# EasyEDA Pro project 舵轮组分电板.eprj

# Schematic Schematic1
Create Date: 2023-06-24; Page Name: P1; Project Name: 舵轮组分电板; Schematic Name: Schematic1; Update Date: 2023-06-24; Company: 嘉立创EDA; Page Size: A4; Version: V1.0
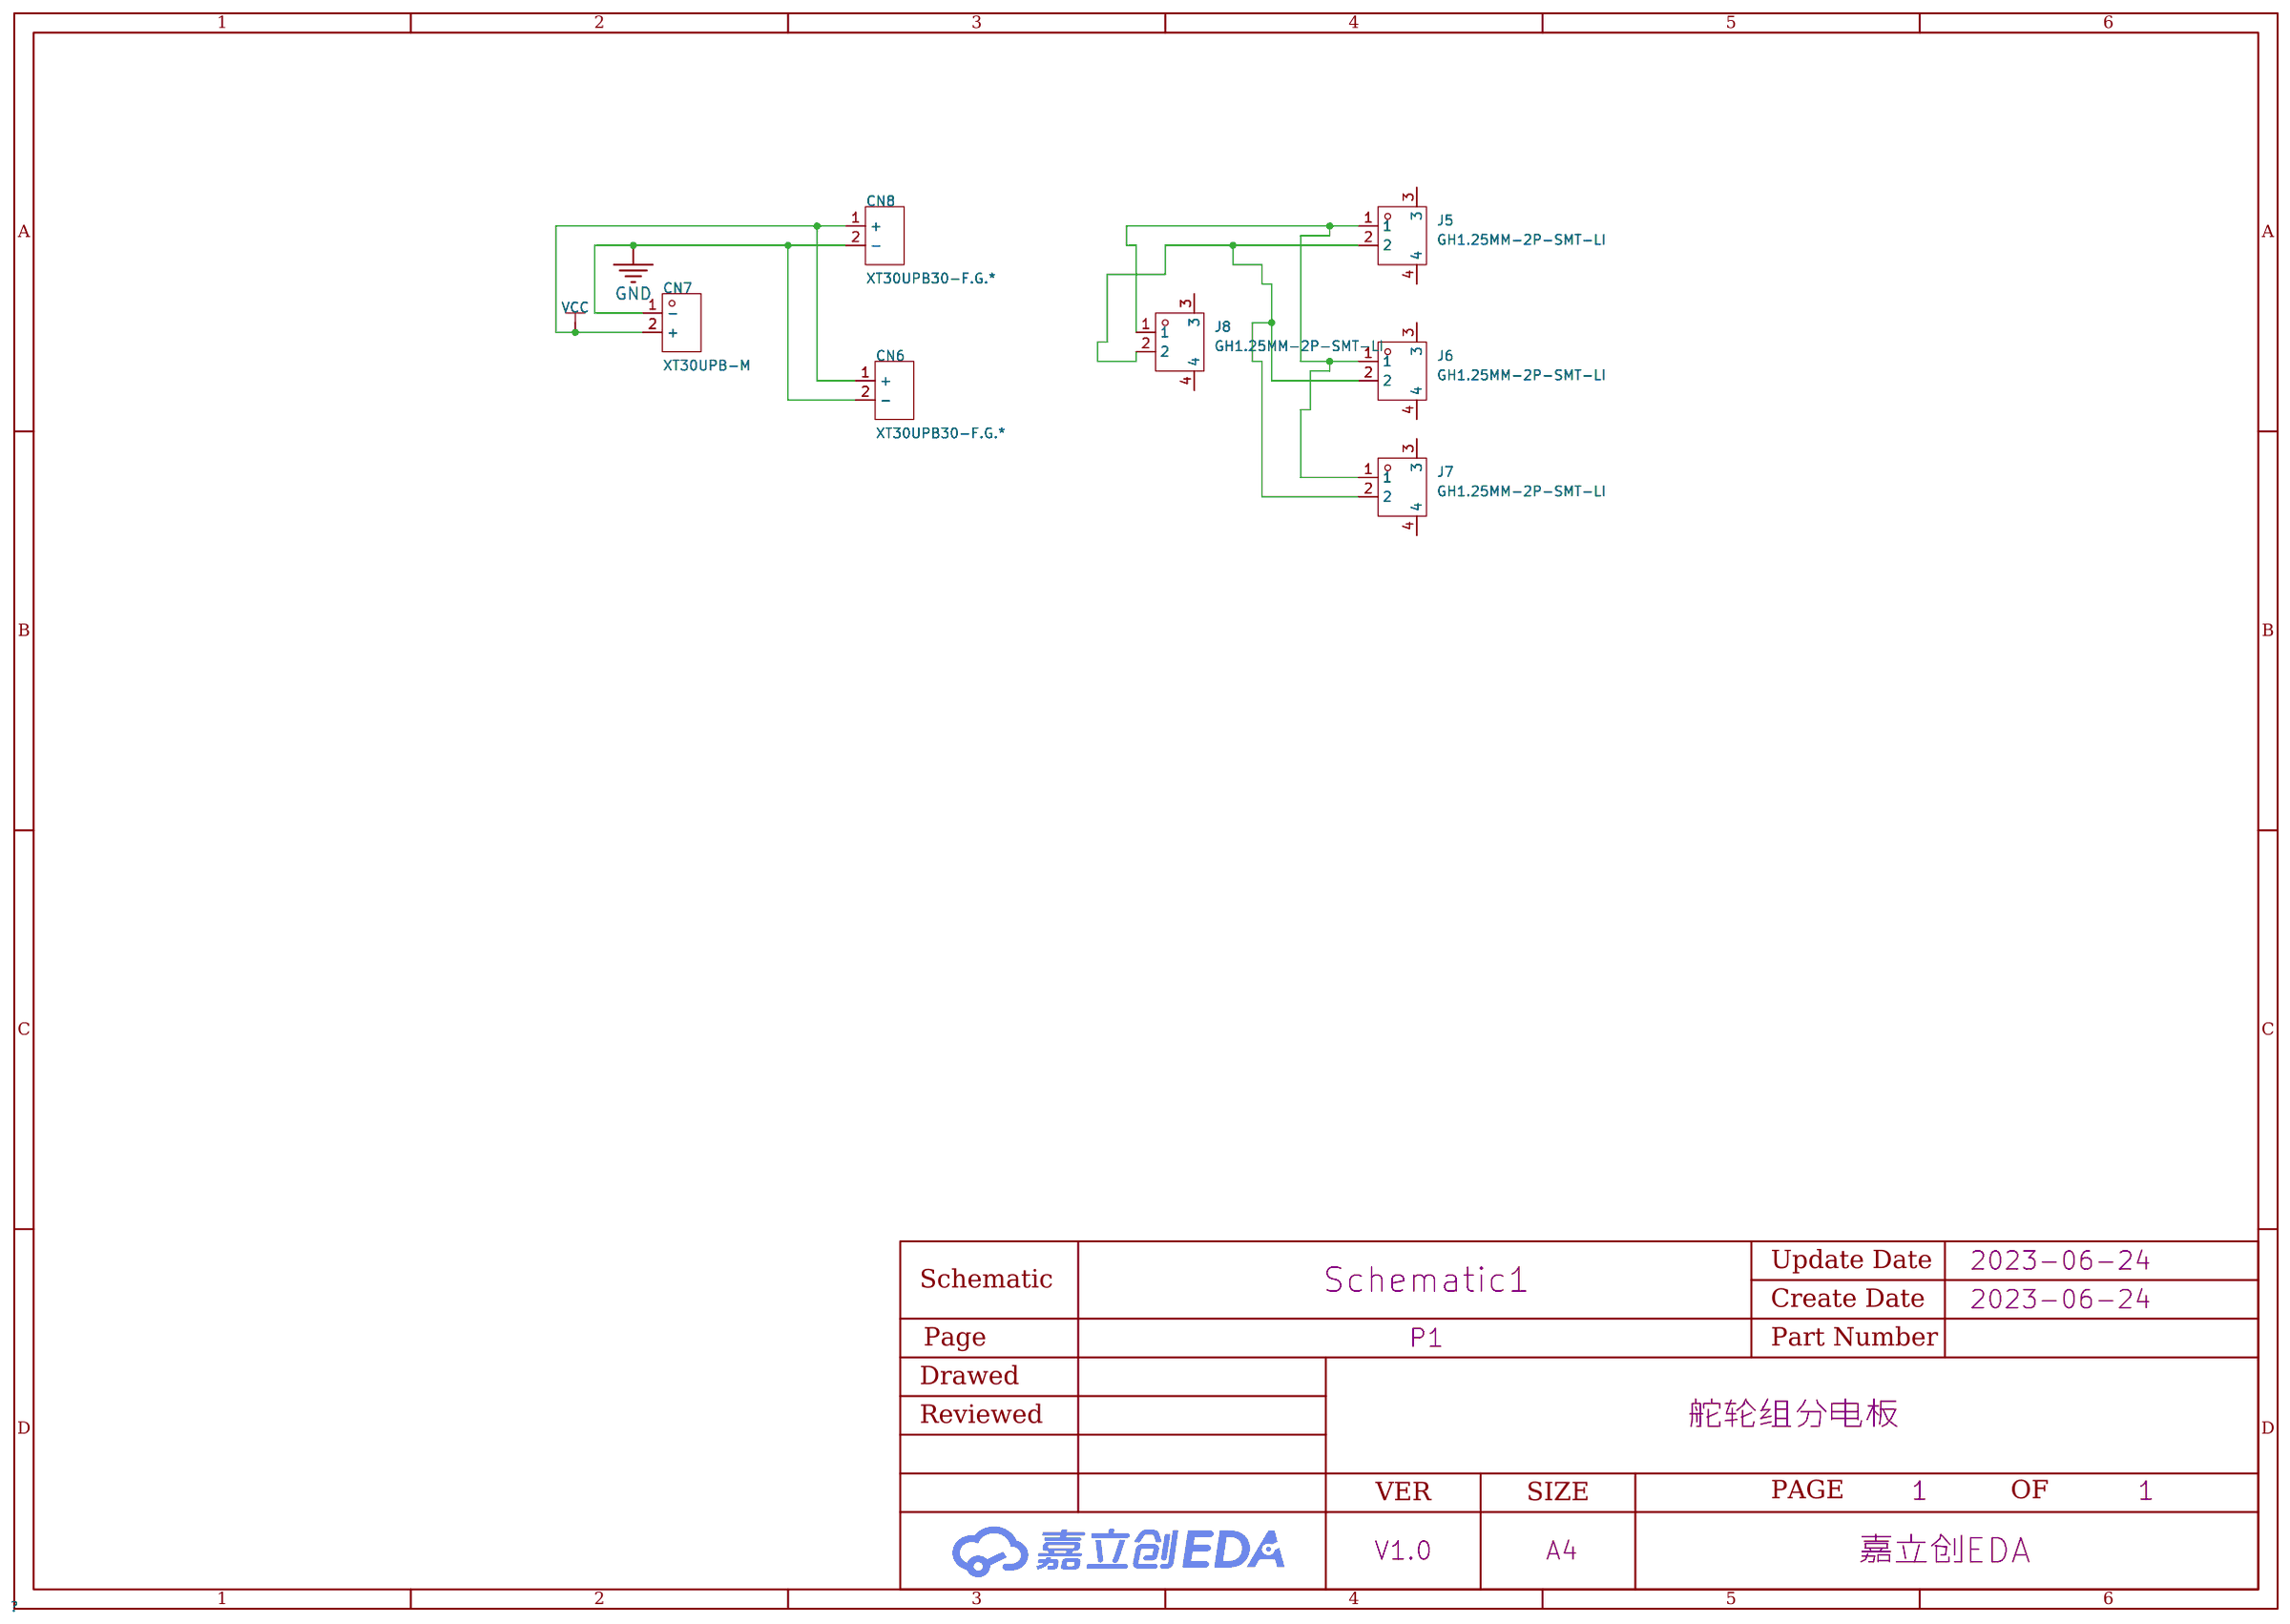
[diagram p0: schematic sheet]

## Parts
CN6  XT30UPB30-F.G.*  [CONN-TH_XT30UPB-F]
CN7  XT30UPB-M  [CONN-TH_XT30UPB-M]
CN8  XT30UPB30-F.G.*  [CONN-TH_XT30UPB-F]
J5  GH1.25MM-2P-SMT-LI  [CONN-SMD_2P-P1.25_GH1.25-2PLI]
J6  GH1.25MM-2P-SMT-LI  [CONN-SMD_2P-P1.25_GH1.25-2PLI]
J7  GH1.25MM-2P-SMT-LI  [CONN-SMD_2P-P1.25_GH1.25-2PLI]
J8  GH1.25MM-2P-SMT-LI  [CONN-SMD_2P-P1.25_GH1.25-2PLI]

## Library data of the parts
CN6 CN8 = XT30UPB30-F.G.*: 模型插头连接器; LCSC Part Name: AMASS(艾迈斯)直立焊板式连接器XT30UPB30-F.G.*; Supplier Part: C108769; Manufacturer: AMASS(艾迈斯); JLCPCB Part Class: Extended Part; Datasheet: https://atta.szlcsc.com/upload/public/pdf/source/20220715/AFD68B9E8B6CA95A7295DBF4AF9325E4.pdf; Supplier: LCSC
CN7 = XT30UPB-M: LCSC Part Name: AMASS(艾迈斯)板载立式 航模锂电池控制器连接器插头 公头XT30UPB-M; Supplier Part: C428721; Manufacturer: AMASS(艾迈斯); JLCPCB Part Class: Extended Part; Datasheet: https://atta.szlcsc.com/upload/public/pdf/source/20190916/C428721_B0ECB8C5937139CEFE8736D2D3175B0E.pdf; Supplier: LCSC
J5-J8 = GH1.25MM-2P-SMT-LI: Supplier Part: C9900017111; Supplier Footprint: GH1.25MM; JLCPCB Part Class: Extended Part; Datasheet: https://atta.szlcsc.comnull; Supplier: LCSC

## Nets
GND: CN6.2(-) CN7.1(-) CN8.2(-)
VCC: CN6.1(+) CN7.2(+) CN8.1(+)
$1N614: J5.1 J6.1 J7.1 J8.1
$1N656: J5.2 J6.2 J7.2 J8.2

Not connected (* = marked no-connect by the designer): J5 3 4; J6 3 4; J7 3 4; J8 3 4

# Board PCB1
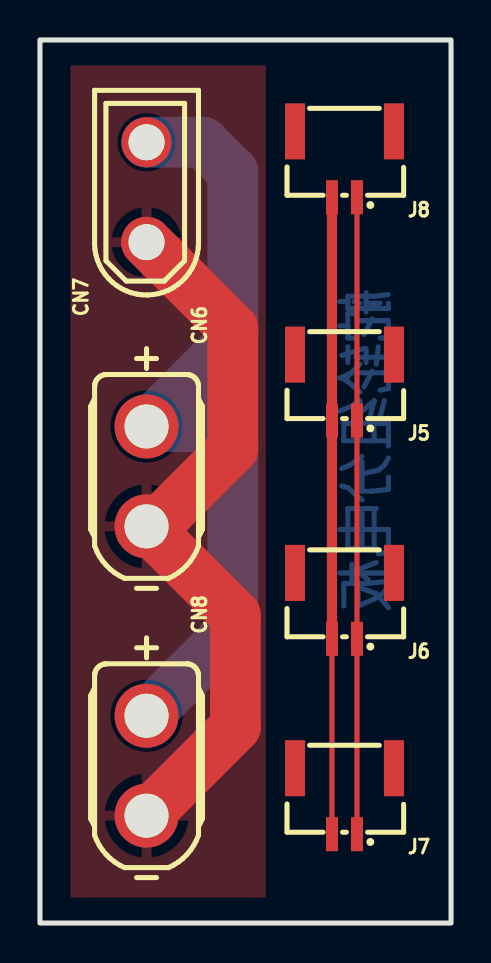
[diagram p1: board, top side]
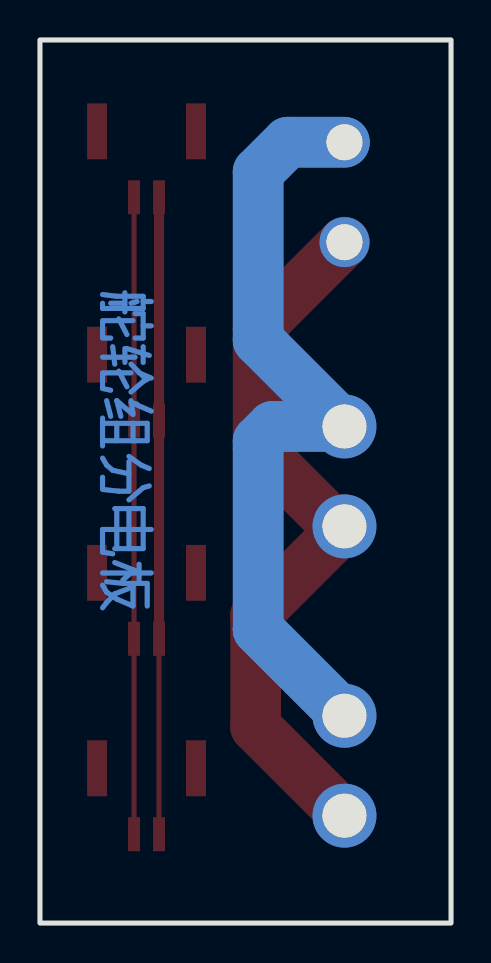
[diagram p2: board, bottom side, seen from below]

Outline 20.57 x 44.2 mm; copper layers: Top Layer, Bottom Layer. Coordinates in mm from the lower left corner of the outline.
Outline path: rectangle 0,44.2 20.57,0
Stack: Top Layer 0.035mm / Dielectric1 1.51mm FR4 er 4.5 / Bottom Layer 0.035mm

## Design rules (mm)
net $1N614: DP1
net $1N656: DP1
template: 自定义配置
spacing copperThickness1oz (default): track to track 0.102, other pairs 0.152 to 0.3
spacing copperThickness2oz: track to track 0.203, other pairs 0.152 to 0.3
track width copperThickness1oz (default): min 0.127, default 0.254, max 2.54
track width copperThickness2oz: min 0.203, default 0.254, max 2.54
differential pair differentialPair (default): width min 0.127, default 0.254, max 2.54; gap min 0.152, default 0.152
via viaSize (default): diameter min 0.5, default 0.61, max 10; hole min 0.3, default 0.305, max 6.3

## Placement (name value [footprint] x y rotation side)
CN6  XT30UPB30-F.G.*  [CONN-TH_XT30UPB-F]  5.33 22.35 270 top
CN7  XT30UPB-M  [CONN-TH_XT30UPB-M]  5.33 36.58 90 top
CN8  XT30UPB30-F.G.*  [CONN-TH_XT30UPB-F]  5.33 7.87 270 top
J5  GH1.25MM-2P-SMT-LI  [CONN-SMD_2P-P1.25_GH1.25-2PLI]  15.24 26.8 180 top
J6  GH1.25MM-2P-SMT-LI  [CONN-SMD_2P-P1.25_GH1.25-2PLI]  15.24 15.88 180 top
J7  GH1.25MM-2P-SMT-LI  [CONN-SMD_2P-P1.25_GH1.25-2PLI]  15.24 6.1 180 top
J8  GH1.25MM-2P-SMT-LI  [CONN-SMD_2P-P1.25_GH1.25-2PLI]  15.24 37.97 180 top

## Footprints (pads in the part's own frame, mm; a bottom-side part is the same pattern mirrored in y, then rotated)
CONN-SMD_2P-P1.25_GH1.25-2PLI
  rect 0.6x1.7 smd: 1(-0.625,1.65) 2(0.625,1.65)
  rect 1x2.8 smd: 3(-2.475,-1.65) 4(2.475,-1.65)
CONN-TH_XT30UPB-F
  round 3.2 hole 2.2: 1(-2.5,0) 2(2.5,0)
CONN-TH_XT30UPB-M
  round 2.5 hole 1.8: 1(-2.5,0) 2(2.5,0)

## Nets
As in the schematic.

Pads without a net: J5 3 4; J6 3 4; J7 3 4; J8 3 4

## Routing (per net, layer and track width the routed paths; a pad name or vN(x,y) marks a point on that pad's centre or on a via; arc(x,y) is an arc through that point)
GND: length 36.2
  Top Layer w2.54: CN8.2 9.78,9.82 9.78,15.41 CN6.2 5.75,19.85 9.65,23.75 9.65,29.76 CN7.1
VCC: length 39.6
  Bottom Layer w2.54: CN8.1 9.65,14.69 9.65,24.13 8.93,24.85 CN6.1 9.65,29.17 9.65,37.59 8.17,39.08 CN7.2
$1N614: length 31.9
  Top Layer w0.254: J8.1 J5.1 J6.1 J7.1
$1N656: length 31.9
  Top Layer w0.254: J6.2 J7.2
  Top Layer w0.508: J8.2 J5.2 J6.2

## Copper pours and planes (outline as drawn; the poured copper is in the pictures)
GND on Top Layer: 1.52,42.93 11.3,42.93 11.3,1.27 1.52,1.27

## Text on the board
Bottom Layer: 舵轮组分电板
